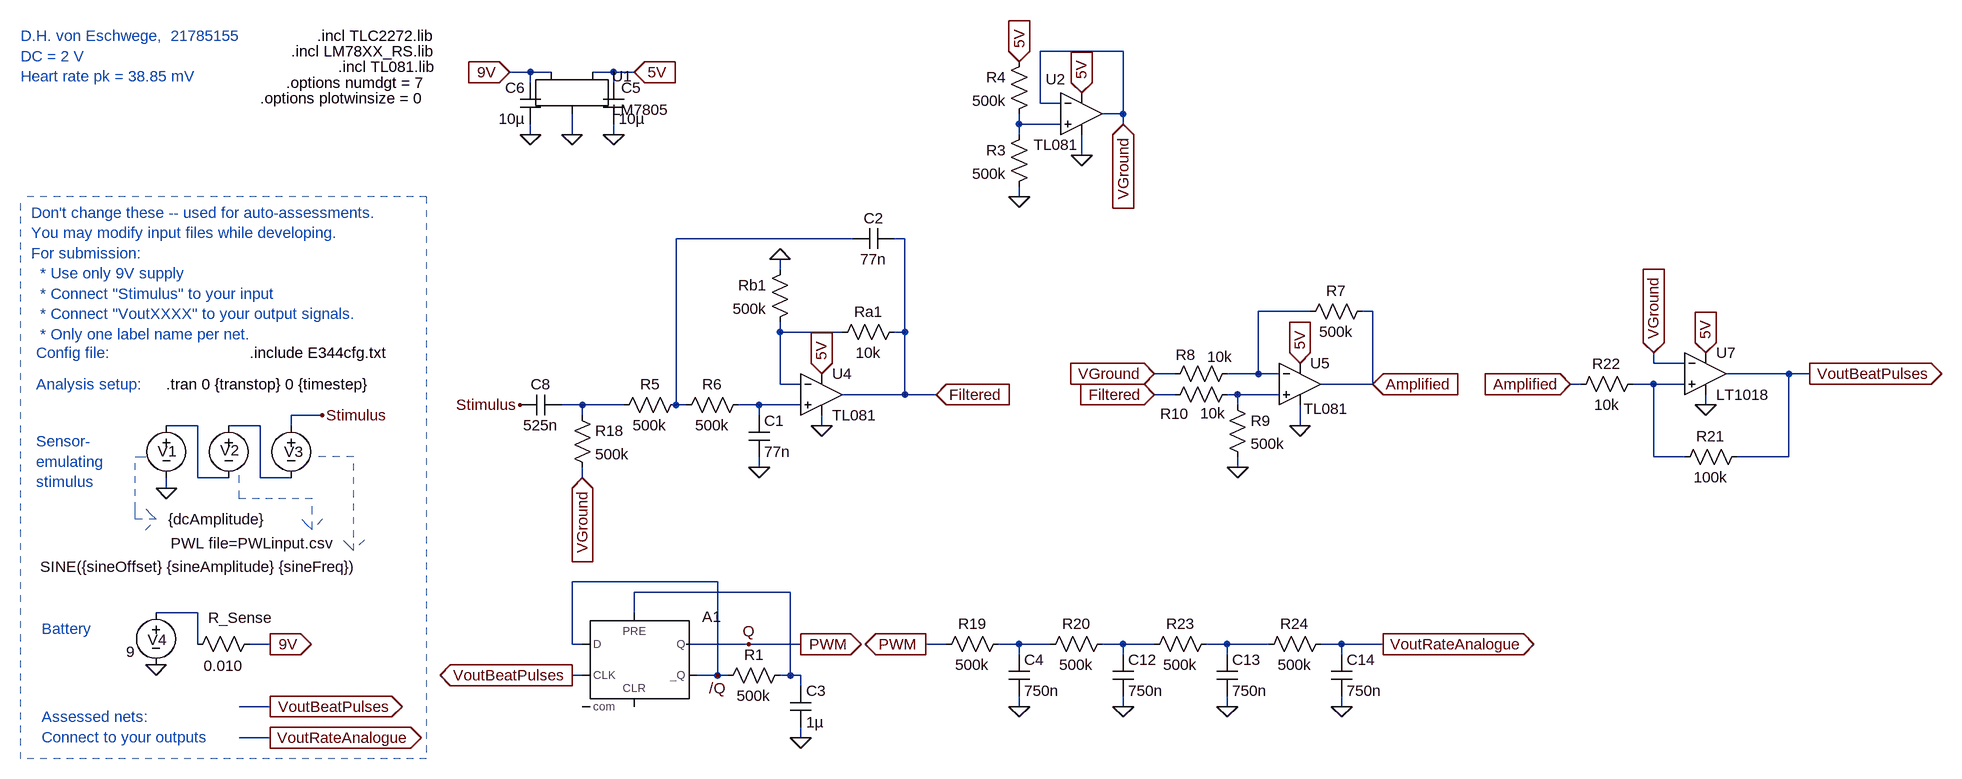
[diagram p0: schematic 21785155.asc]
21785155.asc, the LTspice schematic file:
Version 4
SHEET 1 1824 680
WIRE -608 -1632 -736 -1632
WIRE -1520 -1600 -1552 -1600
WIRE -1488 -1600 -1520 -1600
WIRE -1392 -1600 -1424 -1600
WIRE -1360 -1600 -1392 -1600
WIRE -1520 -1584 -1520 -1600
WIRE -1392 -1584 -1392 -1600
WIRE -736 -1552 -736 -1632
WIRE -704 -1552 -736 -1552
WIRE -608 -1536 -608 -1632
WIRE -608 -1536 -640 -1536
WIRE -768 -1520 -768 -1536
WIRE -704 -1520 -768 -1520
WIRE -608 -1520 -608 -1536
WIRE -1520 -1504 -1520 -1520
WIRE -1456 -1504 -1456 -1536
WIRE -1392 -1504 -1392 -1520
WIRE -768 -1504 -768 -1520
WIRE -672 -1472 -672 -1504
WIRE -768 -1408 -768 -1424
WIRE -1024 -1344 -1296 -1344
WIRE -944 -1344 -960 -1344
WIRE -1136 -1296 -1136 -1312
WIRE -320 -1232 -400 -1232
WIRE -224 -1232 -240 -1232
WIRE -1136 -1200 -1136 -1216
WIRE -1040 -1200 -1136 -1200
WIRE -944 -1200 -944 -1344
WIRE -944 -1200 -960 -1200
WIRE 208 -1152 208 -1168
WIRE 256 -1152 208 -1152
WIRE -528 -1136 -560 -1136
WIRE -400 -1136 -400 -1232
WIRE -400 -1136 -448 -1136
WIRE -368 -1136 -400 -1136
WIRE 416 -1136 320 -1136
WIRE 448 -1136 416 -1136
WIRE -1136 -1120 -1136 -1200
WIRE -1104 -1120 -1136 -1120
WIRE -224 -1120 -224 -1232
WIRE -224 -1120 -304 -1120
WIRE 96 -1120 80 -1120
WIRE 208 -1120 176 -1120
WIRE 256 -1120 208 -1120
WIRE -944 -1104 -944 -1200
WIRE -944 -1104 -1040 -1104
WIRE -896 -1104 -944 -1104
WIRE -528 -1104 -560 -1104
WIRE -432 -1104 -448 -1104
WIRE -368 -1104 -432 -1104
WIRE -1440 -1088 -1472 -1088
WIRE -1376 -1088 -1440 -1088
WIRE -1296 -1088 -1296 -1344
WIRE -1280 -1088 -1296 -1088
WIRE -1168 -1088 -1200 -1088
WIRE -1104 -1088 -1168 -1088
WIRE -432 -1088 -432 -1104
WIRE 288 -1088 288 -1104
WIRE -1840 -1072 -1888 -1072
WIRE -1440 -1072 -1440 -1088
WIRE -1168 -1072 -1168 -1088
WIRE -2032 -1056 -2080 -1056
WIRE -1936 -1056 -1984 -1056
WIRE -1888 -1056 -1888 -1072
WIRE -1072 -1056 -1072 -1072
WIRE -336 -1056 -336 -1088
WIRE 208 -1008 208 -1120
WIRE 256 -1008 208 -1008
WIRE 416 -1008 416 -1136
WIRE 416 -1008 336 -1008
WIRE -1168 -992 -1168 -1008
WIRE -432 -992 -432 -1008
WIRE -2032 -976 -2032 -1056
WIRE -1984 -976 -2032 -976
WIRE -1936 -976 -1936 -1056
WIRE -1888 -976 -1936 -976
WIRE -1440 -976 -1440 -992
WIRE -2080 -960 -2080 -976
WIRE -1232 -816 -1456 -816
WIRE -1120 -800 -1360 -800
WIRE -2032 -768 -2096 -768
WIRE -1360 -768 -1360 -800
WIRE -2032 -720 -2032 -768
WIRE -1920 -720 -1952 -720
WIRE -1456 -720 -1456 -816
WIRE -1440 -720 -1456 -720
WIRE -1184 -720 -1280 -720
WIRE -1104 -720 -1184 -720
WIRE -880 -720 -912 -720
WIRE -768 -720 -800 -720
WIRE -720 -720 -768 -720
WIRE -608 -720 -640 -720
WIRE -560 -720 -608 -720
WIRE -448 -720 -480 -720
WIRE -384 -720 -448 -720
WIRE -272 -720 -304 -720
WIRE -208 -720 -272 -720
WIRE -768 -704 -768 -720
WIRE -608 -704 -608 -720
WIRE -448 -704 -448 -720
WIRE -272 -704 -272 -720
WIRE -1440 -672 -1456 -672
WIRE -1232 -672 -1232 -816
WIRE -1232 -672 -1264 -672
WIRE -1216 -672 -1232 -672
WIRE -1120 -672 -1120 -800
WIRE -1120 -672 -1136 -672
WIRE -1104 -672 -1120 -672
WIRE -1104 -656 -1104 -672
WIRE -1920 -624 -1968 -624
WIRE -768 -624 -768 -640
WIRE -608 -624 -608 -640
WIRE -448 -624 -448 -640
WIRE -272 -624 -272 -640
WIRE -1920 -576 -1968 -576
WIRE -1104 -576 -1104 -592
FLAG -2080 -960 0
FLAG -1840 -1072 Stimulus
FLAG -1920 -720 9V
IOPIN -1920 -720 Out
FLAG -2096 -688 0
FLAG -1920 -624 VoutBeatPulses
IOPIN -1920 -624 Out
FLAG -1920 -576 VoutRateAnalogue
IOPIN -1920 -576 Out
FLAG -1456 -1504 0
FLAG -1552 -1600 9V
IOPIN -1552 -1600 In
FLAG -1520 -1504 0
FLAG -1392 -1504 0
FLAG -1360 -1600 5V
IOPIN -1360 -1600 In
FLAG -768 -1408 0
FLAG -768 -1616 5V
IOPIN -768 -1616 In
FLAG -672 -1472 0
FLAG -672 -1568 5V
IOPIN -672 -1568 In
FLAG -608 -1520 VGround
IOPIN -608 -1520 In
FLAG -1072 -1056 0
FLAG -1168 -992 0
FLAG -1136 -1312 0
FLAG -1072 -1136 5V
IOPIN -1072 -1136 In
FLAG -336 -1056 0
FLAG -432 -992 0
FLAG -336 -1152 5V
IOPIN -336 -1152 In
FLAG 288 -1168 5V
IOPIN 288 -1168 In
FLAG 288 -1088 0
FLAG -1536 -1088 Stimulus
FLAG -1440 -976 VGround
IOPIN -1440 -976 In
FLAG 448 -1136 VoutBeatPulses
IOPIN 448 -1136 Out
FLAG -1184 -720 Q
FLAG -1232 -672 /Q
FLAG -1104 -576 0
FLAG -1456 -672 VoutBeatPulses
IOPIN -1456 -672 Out
FLAG -896 -1104 Filtered
IOPIN -896 -1104 In
FLAG -560 -1104 Filtered
IOPIN -560 -1104 In
FLAG -224 -1120 Amplified
IOPIN -224 -1120 In
FLAG 80 -1120 Amplified
IOPIN 80 -1120 In
FLAG -560 -1136 VGround
IOPIN -560 -1136 In
FLAG 208 -1168 VGround
IOPIN 208 -1168 In
FLAG -1104 -720 PWM
IOPIN -1104 -720 Out
FLAG -768 -624 0
FLAG -608 -624 0
FLAG -448 -624 0
FLAG -272 -624 0
FLAG -912 -720 PWM
IOPIN -912 -720 Out
FLAG -208 -720 VoutRateAnalogue
IOPIN -208 -720 Out
SYMBOL voltage -1984 -1072 R0
WINDOW 123 0 0 Left 0
WINDOW 39 0 0 Left 0
WINDOW 3 -89 197 Left 2
WINDOW 0 -13 54 Left 2
SYMATTR Value PWL file=PWLinput.csv
SYMATTR InstName V2
SYMBOL voltage -1888 -1072 R0
WINDOW 123 24 44 Left 2
WINDOW 39 0 0 Left 0
WINDOW 3 -386 233 Left 2
WINDOW 0 -11 56 Left 2
SYMATTR Value SINE({sineOffset} {sineAmplitude} {sineFreq})
SYMATTR InstName V3
SYMBOL voltage -2080 -1072 R0
WINDOW 123 0 0 Left 0
WINDOW 39 0 0 Left 0
WINDOW 3 3 160 Left 2
WINDOW 0 -13 55 Left 2
SYMATTR Value {dcAmplitude}
SYMATTR InstName V1
SYMBOL voltage -2096 -784 R0
WINDOW 123 24 44 Left 2
WINDOW 39 0 0 Left 0
WINDOW 3 -46 76 Left 2
WINDOW 0 -13 57 Left 2
SYMATTR Value 9
SYMATTR InstName V4
SYMBOL res -1936 -736 R90
WINDOW 0 -9 30 VBottom 2
WINDOW 3 34 56 VTop 2
SYMATTR InstName R_Sense
SYMATTR Value 0.010
SYMBOL LM7805 -1456 -1584 R0
SYMATTR InstName U1
SYMBOL cap -1408 -1584 R0
WINDOW 0 28 8 Left 2
SYMATTR InstName C5
SYMATTR Value 10µ
SYMBOL cap -1504 -1584 M0
SYMATTR InstName C6
SYMATTR Value 10µ
SYMBOL res -752 -1520 M0
SYMATTR InstName R3
SYMATTR Value 500k
SYMBOL res -752 -1632 M0
SYMATTR InstName R4
SYMATTR Value 500k
SYMBOL Opamps\\opamp2 -672 -1600 R0
WINDOW 0 -55 11 Left 2
WINDOW 3 -74 112 Left 2
SYMATTR InstName U2
SYMATTR Value TL081
SYMBOL res -1280 -1104 R90
WINDOW 0 0 56 VBottom 2
WINDOW 3 32 56 VTop 2
SYMATTR InstName R5
SYMATTR Value 500k
SYMBOL cap -1184 -1072 R0
SYMATTR InstName C1
SYMATTR Value 77n
SYMBOL Opamps\\opamp2 -1072 -1168 R0
SYMATTR InstName U4
SYMATTR Value TL081
SYMBOL res -1184 -1104 R90
WINDOW 0 0 56 VBottom 2
WINDOW 3 32 56 VTop 2
SYMATTR InstName R6
SYMATTR Value 500k
SYMBOL res -944 -1216 R90
WINDOW 0 0 56 VBottom 2
WINDOW 3 32 56 VTop 2
SYMATTR InstName Ra1
SYMATTR Value 10k
SYMBOL res -1120 -1312 M0
SYMATTR InstName Rb1
SYMATTR Value 500k
SYMBOL cap -960 -1360 R90
WINDOW 0 0 32 VBottom 2
WINDOW 3 32 32 VTop 2
SYMATTR InstName C2
SYMATTR Value 77n
SYMBOL res -224 -1248 R90
WINDOW 0 0 56 VBottom 2
WINDOW 3 32 56 VTop 2
SYMATTR InstName R7
SYMATTR Value 500k
SYMBOL res -432 -1152 R90
WINDOW 0 2 80 VBottom 2
WINDOW 3 -26 27 VTop 2
SYMATTR InstName R8
SYMATTR Value 10k
SYMBOL Opamps\\opamp2 -336 -1184 R0
WINDOW 3 6 102 Left 2
SYMATTR Value TL081
SYMATTR InstName U5
SYMBOL res -448 -1104 R0
SYMATTR InstName R9
SYMATTR Value 500k
SYMBOL res -432 -1120 R90
WINDOW 0 61 97 VBottom 2
WINDOW 3 29 38 VTop 2
SYMATTR InstName R10
SYMATTR Value 10k
SYMBOL Comparators\\LT1018 288 -1136 R0
SYMATTR InstName U7
SYMBOL cap -1472 -1072 M270
WINDOW 0 32 32 VTop 2
WINDOW 3 0 32 VBottom 2
SYMATTR InstName C8
SYMATTR Value 525n
SYMBOL res -1456 -1088 R0
SYMATTR InstName R18
SYMATTR Value 500k
SYMBOL res 352 -1024 R90
WINDOW 0 0 56 VBottom 2
WINDOW 3 32 56 VTop 2
SYMATTR InstName R21
SYMATTR Value 100k
SYMBOL res 192 -1136 R90
WINDOW 0 0 56 VBottom 2
WINDOW 3 32 56 VTop 2
SYMATTR InstName R22
SYMATTR Value 10k
SYMBOL Digital\\dflop -1360 -768 R0
SYMATTR InstName A1
SYMATTR SpiceLine Vhigh 5 Trise 10n
SYMBOL res -1120 -688 R90
WINDOW 0 0 56 VBottom 2
WINDOW 3 32 56 VTop 2
SYMATTR InstName R1
SYMATTR Value 500k
SYMBOL cap -1120 -656 R0
SYMATTR InstName C3
SYMATTR Value 1µ
SYMBOL res -784 -736 R90
WINDOW 0 0 56 VBottom 2
WINDOW 3 32 56 VTop 2
SYMATTR InstName R19
SYMATTR Value 500k
SYMBOL cap -784 -704 R0
SYMATTR InstName C4
SYMATTR Value 750n
SYMBOL res -624 -736 R90
WINDOW 0 0 56 VBottom 2
WINDOW 3 32 56 VTop 2
SYMATTR InstName R20
SYMATTR Value 500k
SYMBOL cap -624 -704 R0
SYMATTR InstName C12
SYMATTR Value 750n
SYMBOL res -464 -736 R90
WINDOW 0 0 56 VBottom 2
WINDOW 3 32 56 VTop 2
SYMATTR InstName R23
SYMATTR Value 500k
SYMBOL cap -464 -704 R0
SYMATTR InstName C13
SYMATTR Value 750n
SYMBOL res -288 -736 R90
WINDOW 0 0 56 VBottom 2
WINDOW 3 32 56 VTop 2
SYMATTR InstName R24
SYMATTR Value 500k
SYMBOL cap -288 -704 R0
SYMATTR InstName C14
SYMATTR Value 750n
TEXT -2080 -1120 Left 2 !.tran 0 {transtop} 0 {timestep}
TEXT -1952 -1168 Left 2 !.include E344cfg.txt
TEXT -2288 -1384 Left 2 ;Don't change these -- used for auto-assessments.\nYou may modify input files while developing.\nFor submission: \n  * Use only 9V supply \n  * Connect "Stimulus" to your input\n  * Connect "VoutXXXX" to your output signals.\n  * Only one label name per net.
TEXT -2280 -1168 Left 2 ;Config file:
TEXT -2280 -1120 Left 2 ;Analysis setup:
TEXT -2272 -744 Left 2 ;Battery
TEXT -2280 -1032 Left 2 ;Sensor-\nemulating \nstimulus
TEXT -2272 -608 Left 2 ;Assessed nets:\nConnect to your outputs
TEXT -2304 -1656 Left 2 ;D.H. von Eschwege,  21785155\nDC = 2 V\nHeart rate pk = 38.85 mV
TEXT -1848 -1656 Left 2 !.incl TLC2272.lib
TEXT -1888 -1632 Left 2 !.incl LM78XX_RS.lib
TEXT -1816 -1608 Left 2 !.incl TL081.lib
TEXT -1896 -1584 Left 2 !.options numdgt = 7
TEXT -1936 -1560 Left 2 !.options plotwinsize = 0
LINE Normal -1792 -1008 -1856 -1008 2
LINE Normal -1792 -864 -1792 -1008 2
LINE Normal -1808 -880 -1792 -864 2
LINE Normal -1792 -864 -1808 -880 2
LINE Normal -1776 -880 -1792 -864 2
LINE Normal -2128 -1008 -2112 -1008 2
LINE Normal -2128 -928 -2128 -1008 2
LINE Normal -2128 -912 -2128 -928 2
LINE Normal -2096 -912 -2128 -912 2
LINE Normal -2112 -928 -2096 -912 2
LINE Normal -2096 -912 -2112 -928 2
LINE Normal -2112 -896 -2096 -912 2
LINE Normal -1968 -944 -1968 -992 2
LINE Normal -1856 -944 -1968 -944 2
LINE Normal -1856 -896 -1856 -944 2
LINE Normal -1872 -912 -1856 -896 2
LINE Normal -1856 -896 -1872 -912 2
LINE Normal -1840 -912 -1856 -896 2
LINE Normal -2304 -544 -2304 -1408 1
LINE Normal -1680 -1408 -1680 -544 1
LINE Normal -1680 -544 -2304 -544 1
LINE Normal -1680 -1408 -2304 -1408 1

The netlist it stands for:
* 21785155.asc
V2 N010 N009 PWL file=PWLinput.csv
V3 Stimulus N010 SINE({sineOffset} {sineAmplitude} {sineFreq})
V1 N009 0 {dcAmplitude}
V4 N012 0 9
R_Sense 9V N012 0.010
XU1 9V 0 5V LM7805
C5 5V 0 10µ
C6 9V 0 10µ
R3 N001 0 500k
R4 5V N001 500k
XU2 N001 VGround 5V 0 VGround TL081  ; pins In+ In- V+ V- OUT
R5 N002 N007 500k
C1 N008 0 77n
XU4 N008 N004 5V 0 Filtered TL081  ; pins In+ In- V+ V- OUT
R6 N008 N002 500k
Ra1 Filtered N004 10k
Rb1 0 N004 500k
C2 Filtered N002 77n
R7 Amplified N003 500k
R8 N003 VGround 10k
XU5 N006 N003 5V 0 Amplified TL081  ; pins In+ In- V+ V- OUT
R9 N006 0 500k
R10 N006 Filtered 10k
XU7 N005 VGround 5V 0 VoutBeatPulses LT1018  ; pins In+ In- V+ V- OUT
C8 N007 Stimulus 525n
R18 N007 VGround 500k
R21 VoutBeatPulses N005 100k
R22 N005 Amplified 10k
A1 /Q 0 VoutBeatPulses N011 0 /Q PWM 0 DFLOP Vhigh 5 Trise 10n
R1 N011 /Q 500k
C3 N011 0 1µ
R19 N013 PWM 500k
C4 N013 0 750n
R20 N014 N013 500k
C12 N014 0 750n
R23 N015 N014 500k
C13 N015 0 750n
R24 VoutRateAnalogue N015 500k
C14 VoutRateAnalogue 0 750n
.tran 0 {transtop} 0 {timestep}
.include E344cfg.txt
* Don't change these -- used for auto-assessments.
* You may modify input files while developing.
* For submission:
*   * Use only 9V supply
*   * Connect "Stimulus" to your input
*   * Connect "VoutXXXX" to your output signals.
*   * Only one label name per net.
* Config file:
* Analysis setup:
* Battery
* Sensor-
* emulating
* stimulus
* Assessed nets:
* Connect to your outputs
* D.H. von Eschwege,  21785155
* DC = 2 V
* Heart rate pk = 38.85 mV
.incl TLC2272.lib
.incl LM78XX_RS.lib
.incl TL081.lib
.options numdgt = 7
.options plotwinsize = 0
.lib LTC1.lib
.backanno
.end